# Altium schematic sheet ESP8266 ESP-01 Schematic.SchDoc: ESP-01 Connection Diagram
size A4
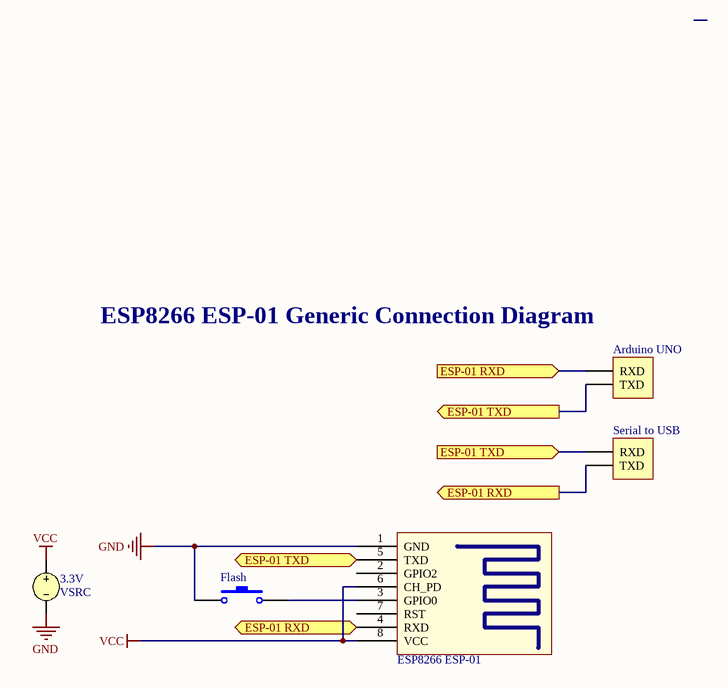
[diagram p0: ESP8266 ESP-01 Schematic.SchDoc]

## Parts
3.3V  VSRC
Arduino_UNO  Header 2  [HDR1X2]  (value not drawn)
ESP-01  ESP8266 ESP-01  [ESP8266 ESP-07]
Flash  SW-PB  [SPST-2]  (value not drawn)
Serial_to_USB  Header 2  [HDR1X2]  (value not drawn)

## Ports
ESP-01 RXD (in), ESP-01 RXD (out), ESP-01 TXD (in), ESP-01 TXD (out)

## Nets
GND: 3.3V.2 ESP-01.1(GND) Flash.1
VCC: 3.3V.1 ESP-01.6(CH_PD) ESP-01.8(VCC)
ESP-01 RXD: Arduino_UNO.1(RXD) ESP-01.4(RXD) Serial_to_USB.2(TXD) ; port ESP-01 RXD
ESP-01 TXD: Arduino_UNO.2(TXD) ESP-01.5(TXD) Serial_to_USB.1(RXD) ; port ESP-01 TXD
NetESP-01_3: ESP-01.3(GPIO0) Flash.2

Not connected (* = marked no-connect by the designer): ESP-01 2(GPIO2) 7(RST)

## Notes on the sheet
- (near Arduino_UNO) ESP8266 ESP-01 Generic Connection Diagram
- Title
- Size:
- Date:
- A4
- Number:
- Time:
- Revision:
- Sheet
- of
- File:

## Library data of the parts
3.3V = VSRC: Voltage Source; Note: PCB Footprint - Not required; Published: 8-Jun-2000; LatestRevisionDate: 17-Jul-2002; LatestRevisionNote: Re-released for DXP Platform.; PackageReference: Not Applicable; Publisher: Altium Limited
Arduino_UNO Serial_to_USB = Header 2: Header, 2-Pin; LatestRevisionDate: 17-Jul-2002; LatestRevisionNote: Re-released for DXP Platform.; Publisher: Altium Limited
Flash = SW-PB: Switch; Published: 24-Mar-1999; LatestRevisionDate: 17-Jul-2002; LatestRevisionNote: Re-released for DXP Platform.; PackageReference: SPST-2; Publisher: Altium Limited; PackageDescription: Switch; 2 Leads